# EAGLE design Rev0_4 (EAGLE 6.3)
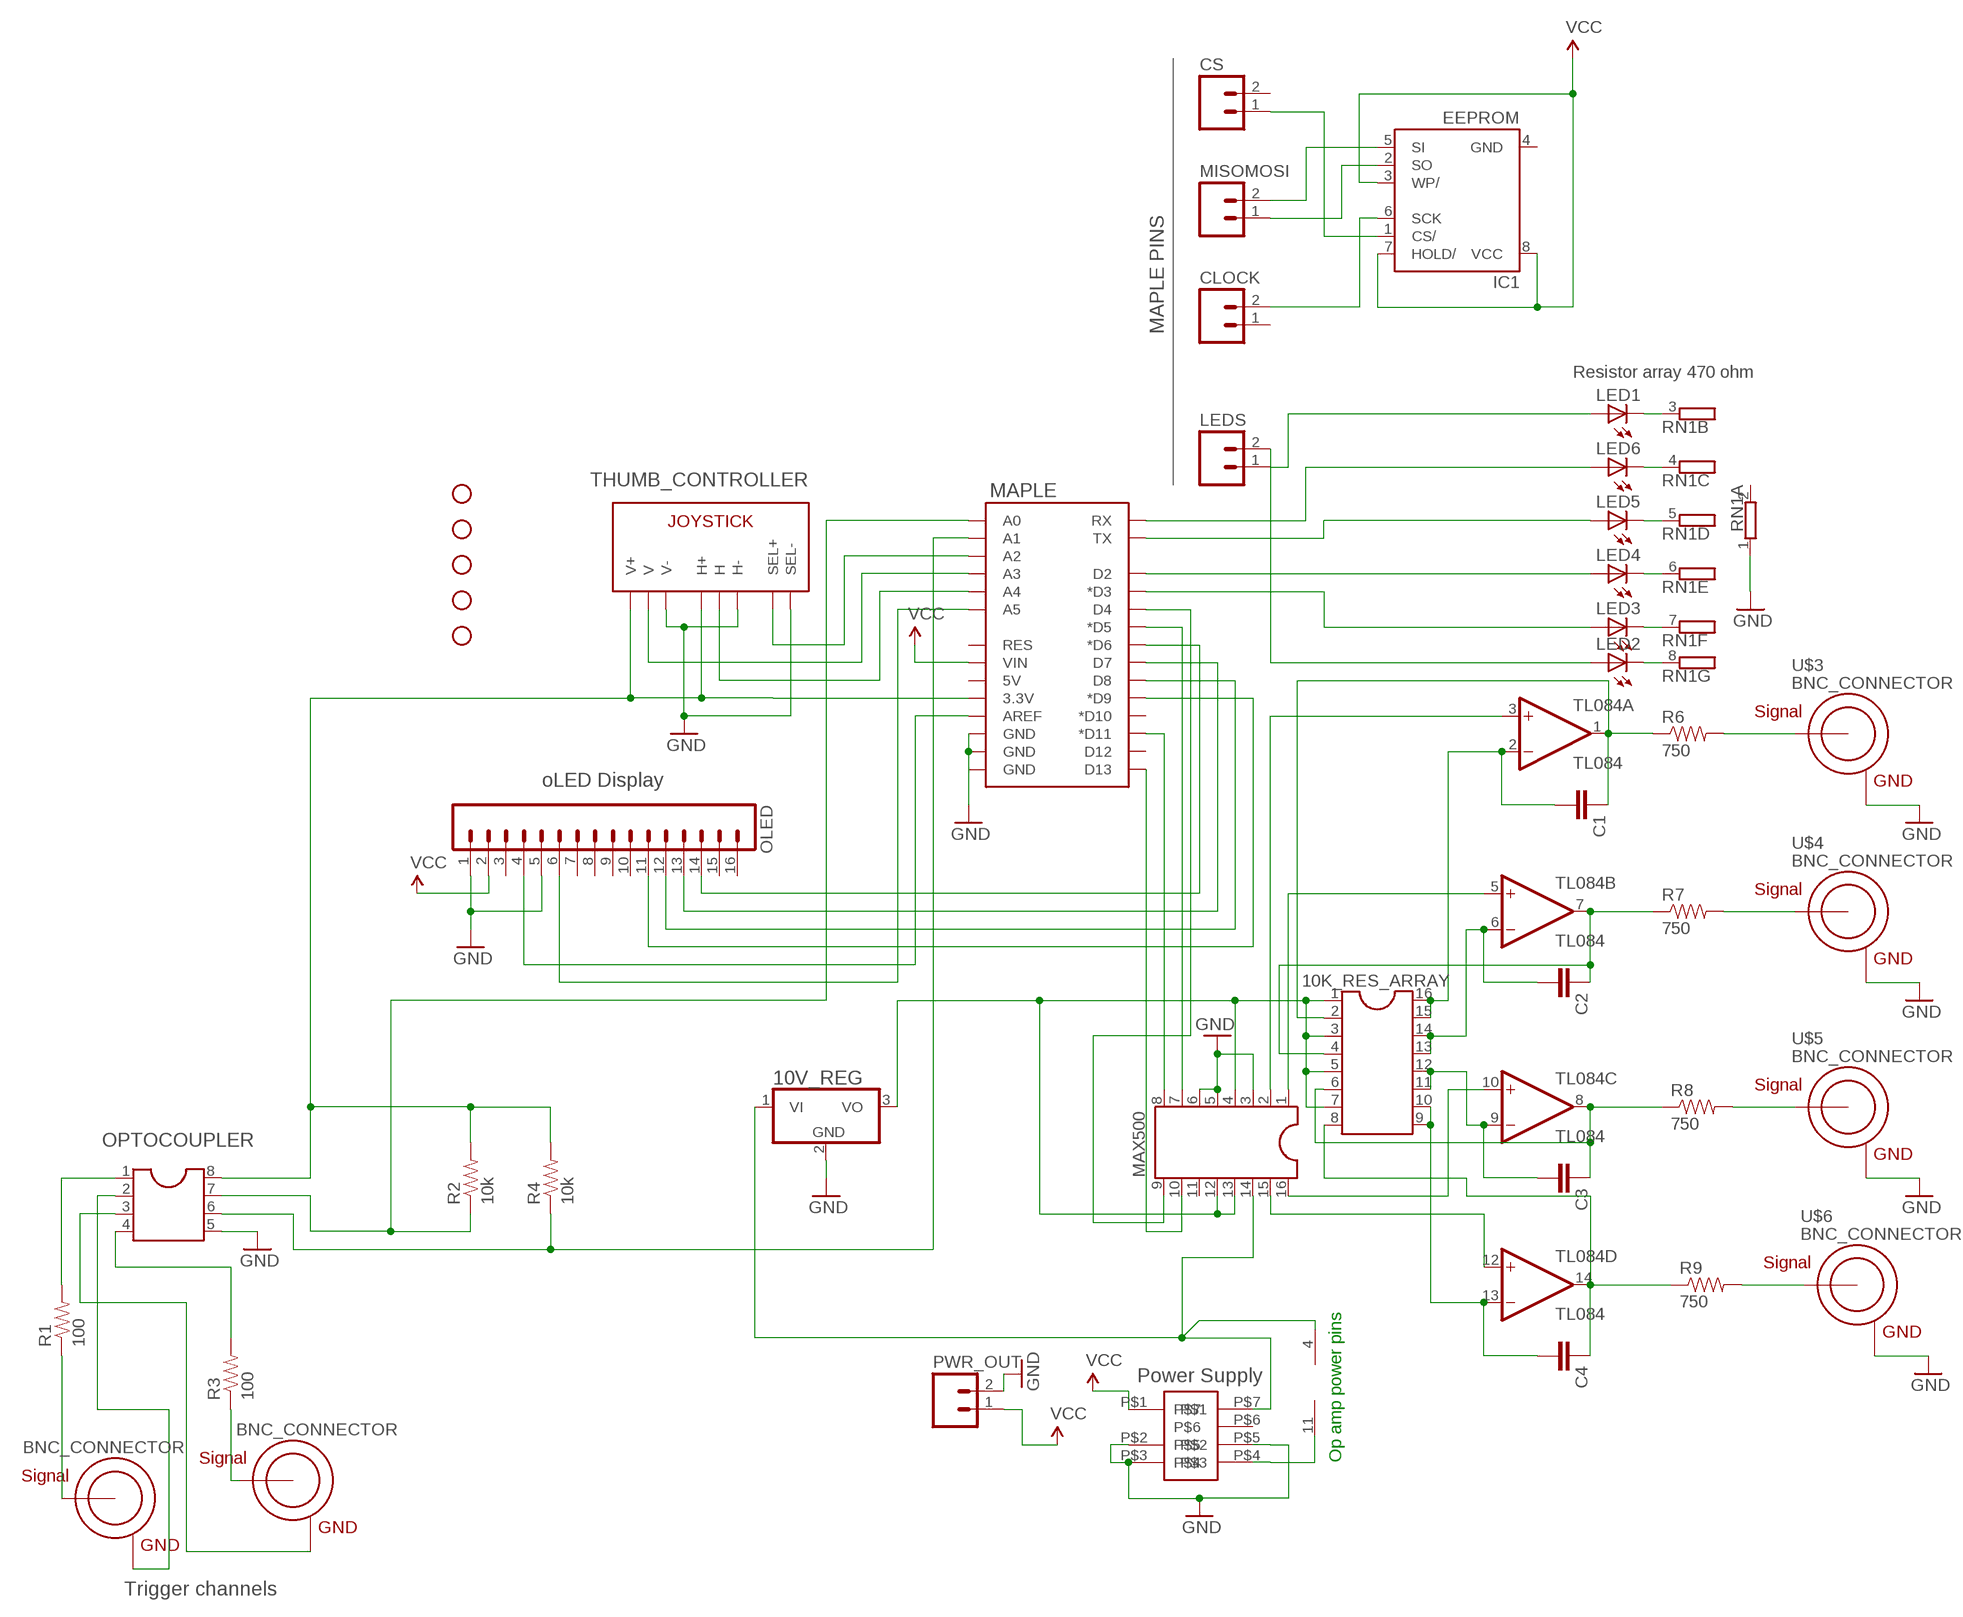
[diagram p0: schematic, sheet 1]

## Parts
10K_RES_ARRAY  DIL16  [DIL16]
10V_REG  7805T  [TO220H]
C1  CAPPTH  [CAP-PTH-SMALL]
C2  CAPPTH  [CAP-PTH-SMALL]
C3  CAPPTH  [CAP-PTH-SMALL]
C4  CAPPTH  [CAP-PTH-SMALL]
CLOCK  M02PTH  [1X02]
CS  M02PTH  [1X02]
IC1  EEPROM  AT25P  [DIL08]
JP2  STAND-OFF  [STAND-OFF]
JP5  STAND-OFF  [STAND-OFF]
JP6  STAND-OFF  [STAND-OFF]
JP8  STAND-OFF  [STAND-OFF]
JP9  STAND-OFF  [STAND-OFF]
LED1  LED3MM  [LED3MM]
LED2  LED3MM  [LED3MM]
LED3  LED3MM  [LED3MM]
LED4  LED3MM  [LED3MM]
LED5  LED3MM  [LED3MM]
LED6  LED3MM  [LED3MM]
LEDS  M02PTH  [1X02]
MAPLE  ARDUINO_SHIELDNOHOLESORLABELS  [DUEMILANOVE_SHIELD_NOHOLES_NOLABELS]
MAX500  DIL16  [DIL16]
MISOMOSI  M02PTH  [1X02]
OLED  M16PTH  [1X16]
OPTOCOUPLER  DIL8  [DIL08]
PWR_OUT  M02PTH  [1X02]
R1  100  RESISTORAXIAL-0.3  [AXIAL-0.3]
R2  10k  RESISTORAXIAL-0.3  [AXIAL-0.3]
R3  100  RESISTORAXIAL-0.3  [AXIAL-0.3]
R4  10k  RESISTORAXIAL-0.3  [AXIAL-0.3]
R6  750  RESISTORAXIAL-0.3  [AXIAL-0.3]
R7  750  RESISTORAXIAL-0.3  [AXIAL-0.3]
R8  750  RESISTORAXIAL-0.3  [AXIAL-0.3]
R9  750  RESISTORAXIAL-0.3  [AXIAL-0.3]
RN1  GE07R  [SIL8]
THUMB_CONTROLLER  JOYSTICKPTH  [JOYSTICK]
TL084  TL084  TL084P  [DIL14]
U$1  BNC_CONNECTOR  [BNC_CONNECTOR]
U$2  BNC_CONNECTOR  [BNC_CONNECTOR]
U$3  BNC_CONNECTOR  [BNC_CONNECTOR]
U$4  BNC_CONNECTOR  [BNC_CONNECTOR]
U$5  BNC_CONNECTOR  [BNC_CONNECTOR]
U$6  BNC_CONNECTOR  [BNC_CONNECTOR]
U$8  TDK_LAMBDA_5_TO_BI_12_125MA  [TDK_LAMBDA_5_TO_BI_12_125MA]

## Nets
GND: 10V_REG.2(GND) MAPLE.GND@0(GND) MAPLE.GND@1(GND) MAPLE.GND@2(GND) MAX500.3 MAX500.5 MAX500.6 OLED.1 OLED.5 OPTOCOUPLER.5 PWR_OUT.2 RN1.1 THUMB_CONTROLLER.B2A(SEL-) THUMB_CONTROLLER.H3(H-) THUMB_CONTROLLER.V3(V-) U$3.GND U$4.GND U$5.GND U$6.GND U$8.P$2 U$8.P$3 U$8.P$5
N$1: LED6.A MAPLE.RX
N$2: LED5.A MAPLE.TX
N$3: LED4.A MAPLE.D2
N$4: LED3.A MAPLE.D3(*D3)
N$5: MAPLE.D11(*D11) MAX500.8
N$6: MAPLE.D13 MAX500.10
N$7: MAPLE.AREF OLED.4
N$8: MAPLE.D4 MAX500.9
N$9: MAPLE.D5(*D5) MAX500.7
N$10: MAPLE.D6(*D6) OLED.14
N$11: MAPLE.D7 OLED.13
N$12: MAPLE.D8 OLED.12
N$13: MAPLE.D9(*D9) OLED.11
N$14: MAPLE.A5 OLED.6
N$15: MAPLE.A4 THUMB_CONTROLLER.H2(H)
N$16: MAPLE.A3 THUMB_CONTROLLER.V2(V)
N$17: MAPLE.A2 THUMB_CONTROLLER.B1A(SEL+)
N$19: R1.P$1 U$1.SIGNAL
N$20: MAPLE.A0 OPTOCOUPLER.7 R2.P$1
N$21: R3.P$1 U$2.SIGNAL
N$22: MAPLE.A1 OPTOCOUPLER.6 R4.P$1
N$23: TL084.11(P:V-) U$8.P$4
N$24: MAX500.2 TL084.3(A:+IN)
N$25: MAX500.1 TL084.5(B:+IN)
N$28: 10V_REG.1(VI) MAX500.14 TL084.4(P:V+) U$8.P$7
N$29: 10K_RES_ARRAY.1 10K_RES_ARRAY.3 10K_RES_ARRAY.5 10K_RES_ARRAY.7 10V_REG.3(VO) MAX500.4 MAX500.12 MAX500.13
N$30: MAX500.16 TL084.10(C:+IN)
N$31: MAX500.15 TL084.12(D:+IN)
N$32: 10K_RES_ARRAY.2 C1.1 R6.P$1 TL084.1(A:OUT)
N$33: 10K_RES_ARRAY.4 C2.1 R7.P$1 TL084.7(B:OUT)
N$34: 10K_RES_ARRAY.6 C3.1 R8.P$1 TL084.8(C:OUT)
N$35: 10K_RES_ARRAY.8 C4.1 R9.P$1 TL084.14(D:OUT)
N$36: LED1.A LEDS.1
N$37: LED2.A LEDS.2
N$38: LED2.K(C) RN1.8
N$39: LED3.K(C) RN1.7
N$40: LED4.K(C) RN1.6
N$41: LED5.K(C) RN1.5
N$42: LED6.K(C) RN1.4
N$43: 10K_RES_ARRAY.15 10K_RES_ARRAY.16 C1.2 TL084.2(A:-IN)
N$44: 10K_RES_ARRAY.13 10K_RES_ARRAY.14 C2.2 TL084.6(B:-IN)
N$45: 10K_RES_ARRAY.11 10K_RES_ARRAY.12 C3.2 TL084.9(C:-IN)
N$46: 10K_RES_ARRAY.9 10K_RES_ARRAY.10 C4.2 TL084.13(D:-IN)
N$47: LED1.K(C) RN1.3
N$48: R6.P$2 U$3.SIGNAL
N$49: R7.P$2 U$4.SIGNAL
N$50: R8.P$2 U$5.SIGNAL
N$51: R9.P$2 U$6.SIGNAL
N$52: OPTOCOUPLER.1 R1.P$2
N$53: CS.1 IC1.1(CS/)
N$54: IC1.5(SI) MISOMOSI.2
N$55: IC1.2(SO) MISOMOSI.1
N$56: CLOCK.2 IC1.6(SCK)
N$57: OPTOCOUPLER.2 U$1.GND
N$58: OPTOCOUPLER.4 R3.P$2
N$60: OPTOCOUPLER.3 U$2.GND
N$61: MAPLE.3.3V OPTOCOUPLER.8 R2.P$2 R4.P$2 THUMB_CONTROLLER.H1(H+) THUMB_CONTROLLER.V1(V+)
VCC: IC1.3(WP/) IC1.7(HOLD/) IC1.8(VCC) MAPLE.VIN OLED.2 PWR_OUT.1 U$8.P$1
Unconnected: CLOCK.1 CS.2 MAPLE.5V MAPLE.D10(*D10) MAPLE.D12 MAPLE.RES MAX500.11 OLED.3 OLED.7 OLED.8 OLED.9 OLED.10 OLED.15 OLED.16 RN1.2 U$8.P$6

## Notes on the sheet
- MAPLE PINS
- Resistor array 470 ohm
- oLED Display
- Power Supply
- Op amp power pins
- Trigger channels

## Power pins joined to a net without a drawn wire
GND: IC1.4(GND)

## Library data of the parts
10K_RES_ARRAY MAX500 = ic-package:DIL16: Dual In Line / Socket
10V_REG = linear:78*: Positive VOLTAGE REGULATOR Source: http://cache.national.com/ds/LM/LM78L05.pdf http://www.fairchildsemi.com/ds/LM/LM7805.pdf
C1-C4 = SparkFun:CAP: Capacitor Standard 0603 ceramic capacitor, and 0.1" leaded capacitor.
CLOCK CS LEDS MISOMOSI PWR_OUT = SparkFun:M02: Header 2 Standard 2-pin 0.1" header. Use with straight break away headers (SKU : PRT-00116), right angle break away headers (PRT-00553), swiss pins (PRT-00743), machine pins (PRT-00117), and female headers (PRT-00115). Molex polarized connector foot print use with SKU : PRT-08233 with associated crimp pins and housings.
IC1 = atmel:AT25*: SPI bus serial EEPROM
JP2 JP5 JP6 JP8 JP9 = SparkFun:STAND-OFF: Stand Off This is the mechanical footprint for a #4 phillips button head screw. Use the keepout ring to avoid running the screw head into surrounding components. SKU : PRT-00447
LED1-LED6 = SparkFun:LED: LEDs Standard schematic elements and footprints for 5mm, 3mm, 1206, and 0603 sized LEDs. 5mm - Spark Fun Electronics SKU : COM-00529 (and others)
MAPLE = SparkFun:ARDUINO_SHIELD
OLED = SparkFun:M16
OPTOCOUPLER = ic-package:DIL8: Dual In Line / Socket
R1-R4 R6-R9 = SparkFun:RESISTOR: Resistor Basic schematic elements and footprints for 0603, 1206, and PTH resistors.
RN1 = resistor-sil:GE07R: SIL RESISTOR
THUMB_CONTROLLER = SparkFun:JOYSTICK: Thumb Joystick Joystick commonly found in PS2 controllers. Two pots and a select switch. Footprint proven. Spark Fun Electronics SKU : COM-09032
TL084 = linear:TL084: OP AMP
U$1-U$6 = JoshParts:BNC_CONNECTOR
U$8 = JoshParts:TDK_LAMBDA_5_TO_BI_12_125MA

## Net classes
0 default: width 0.203 mm
1 vcc: width 0.254 mm

## Board
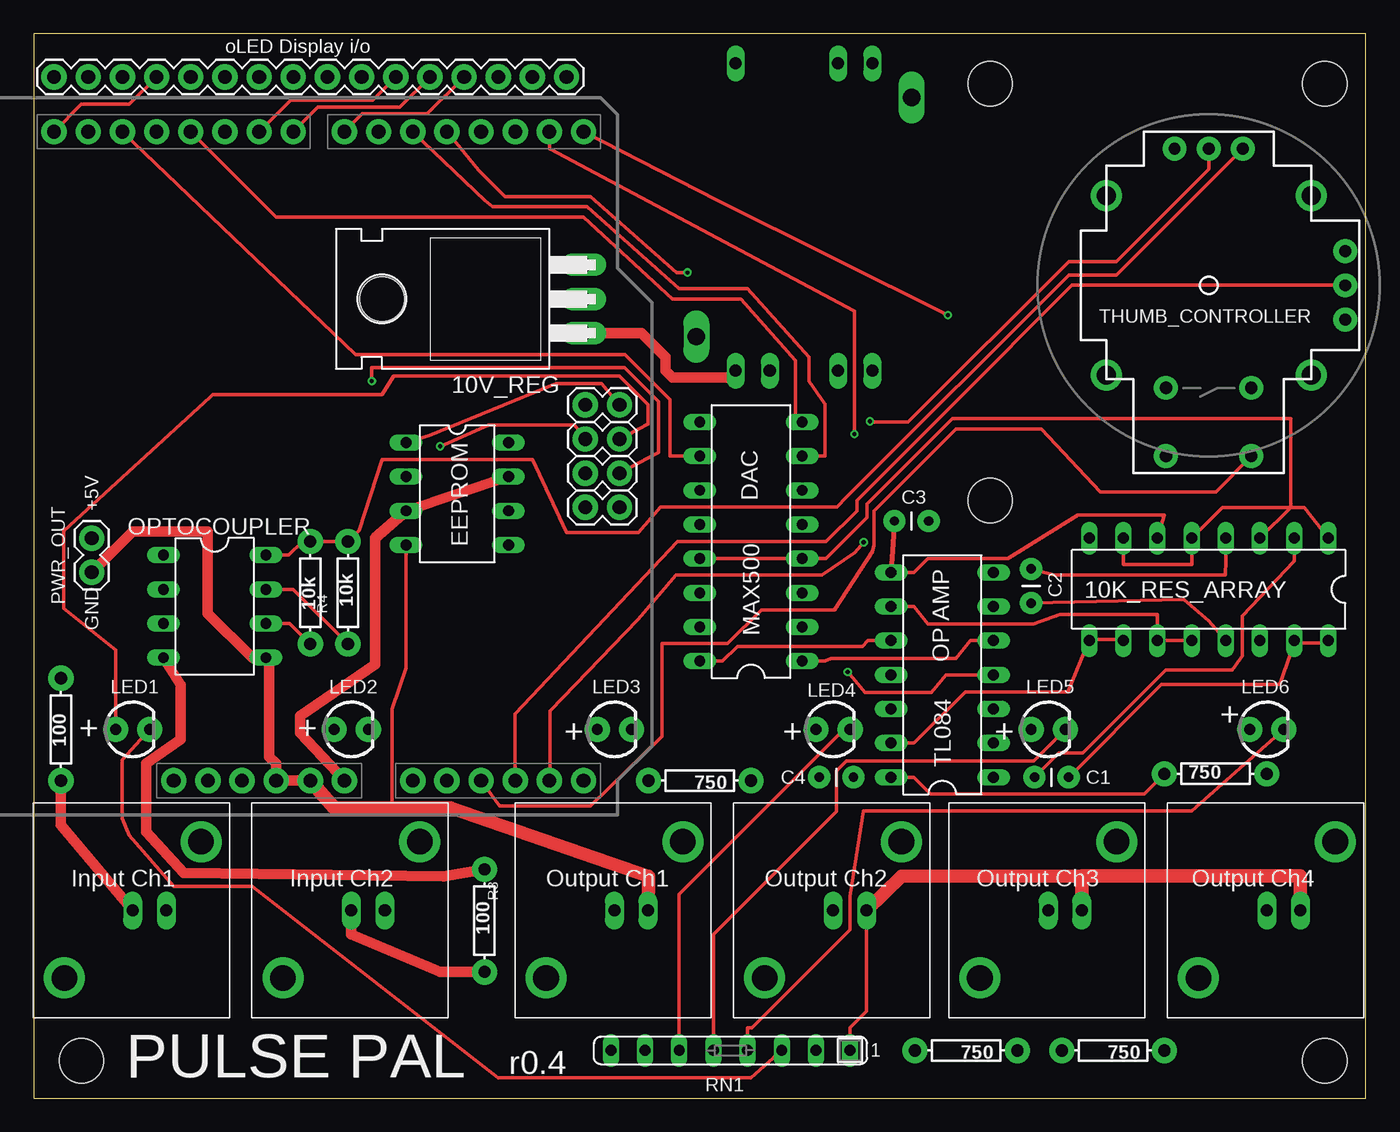
[diagram p1: board, top side]
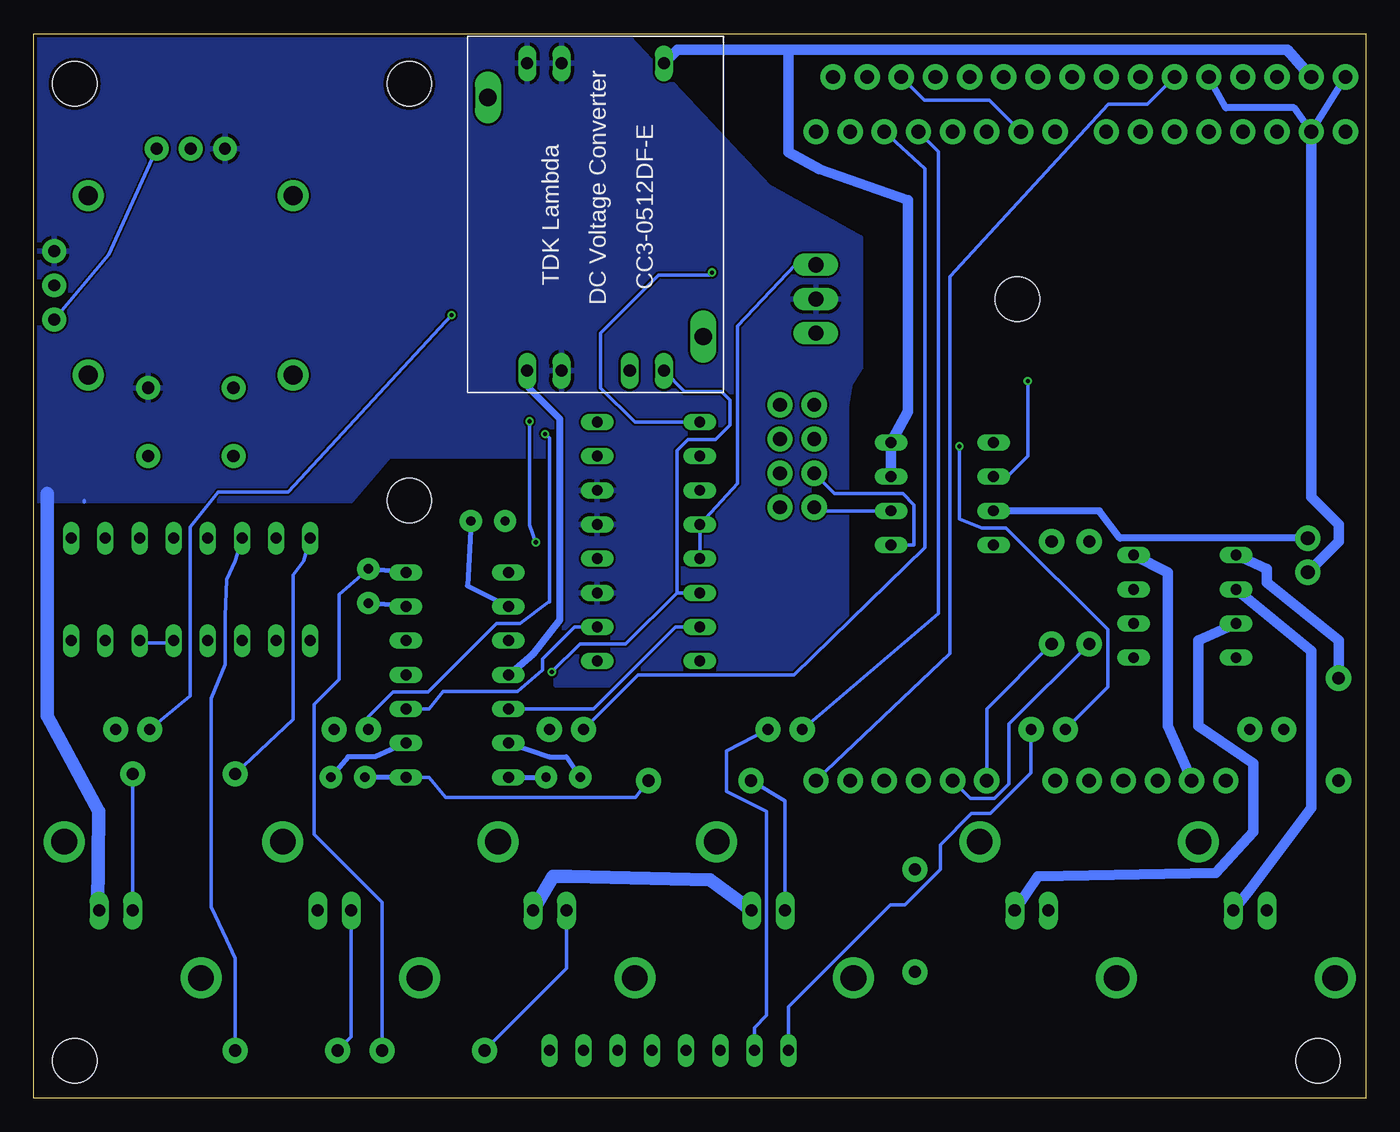
[diagram p2: board, bottom side, seen from below]

Size 99.04 x 79.17 mm. Coordinates in mm from the lower left corner, seen from the top.
Outline: 99.04,79.17 0,79.17 0,0 99.04,0 99.04,79.17
Copper layers (1*2*15*16): Top 0.035mm / dielectric 0.2mm / Route2 0.0175mm / dielectric 1.1mm / Route15 0.0175mm / dielectric 0.2mm / Bottom 0.035mm
Design rules "SeeedStudio_DRU_no_angle_20130527": minimum track width 6mil, minimum drill 12mil, track to track 6mil, track to pad 6mil, pad to pad 6mil, via to via 6mil, smd to smd 0mil, copper to edge 10mil, drill to drill 10mil, minimum pad ring 6mil, minimum via ring 6mil, stop-mask expansion 2mil, vias tented up to drill 25mil, thermal gap 10mil

### Footprints (pad centres in the part's own frame; a part is rotated, then mirrored left to right if it is on the bottom)
DIL16 = drill 0.813 long: 1 -8.89,-3.81; 2 -6.35,-3.81; 3 -3.81,-3.81; 4 -1.27,-3.81; 5 1.27,-3.81; 6 3.81,-3.81; 7 6.35,-3.81; 8 8.89,-3.81; 9 8.89,3.81; 10 6.35,3.81; 11 3.81,3.81; 12 1.27,3.81; 13 -1.27,3.81; 14 -3.81,3.81; 15 -6.35,3.81; 16 -8.89,3.81
TO220H = drill 1.118 long: 1 -2.54,-10.16; 2 0,-10.16; 3 2.54,-10.16 | hole 3.302: 0,4.826
CAP-PTH-SMALL = drill 0.7 pad 1.651: 1 0,0; 2 2.54,0
1X02 = drill 1.016 pad 1.88: 1 0,0; 2 2.54,0
DIL08 = drill 0.813 long: 1 -3.81,-3.81; 2 -1.27,-3.81; 3 1.27,-3.81; 4 3.81,-3.81; 5 3.81,3.81; 6 1.27,3.81; 7 -1.27,3.81; 8 -3.81,3.81
STAND-OFF = hole 3.302: 0,0
LED3MM = drill 0.813 pad 1.88: A -1.27,0; K 1.27,0
DUEMILANOVE_SHIELD_NOHOLES_NOLABELS = drill 1.016 pad 1.88: 3.3V 50.8,26.67; 5V 50.8,29.21; A0 50.8,41.91; A1 50.8,44.45; A2 50.8,46.99; A3 50.8,49.53; A4 50.8,52.07; A5 50.8,54.61; AREF 2.54,15.24; D2 2.54,49.53; D3 2.54,46.99; D4 2.54,44.45; D5 2.54,41.91; D6 2.54,39.37; D7 2.54,36.83; D8 2.54,33.02; D9 2.54,30.48; D10 2.54,27.94; D11 2.54,25.4; D12 2.54,22.86; D13 2.54,20.32; GND@0 50.8,31.75; GND@1 50.8,34.29; GND@2 2.54,17.78; RES 50.8,24.13; RX 2.54,54.61; TX 2.54,52.07; VIN 50.8,36.83
1X16 = drill 1.016 pad 1.88: 1 0,0; 2 2.54,0; 3 5.08,0; 4 7.62,0; 5 10.16,0; 6 12.7,0; 7 15.24,0; 8 17.78,0; 9 20.32,0; 10 22.86,0; 11 25.4,0; 12 27.94,0; 13 30.48,0; 14 33.02,0; 15 35.56,0; 16 38.1,0
AXIAL-0.3 = drill 0.9 pad 1.88: P$1 -3.81,0; P$2 3.81,0
SIL8 = drill 0.813 long: 1 -8.89,0; 2 -6.35,0; 3 -3.81,0; 4 -1.27,0; 5 1.27,0; 6 3.81,0; 7 6.35,0; 8 8.89,0
JOYSTICK = drill 0.9 pad 1.778: B1A -3.175,12.7; B1B 3.175,12.7; B2A -3.175,7.62; B2B 3.175,7.62 | drill 0.889 pad 1.778: H1 -2.54,-10.16; H2 0,-10.16; H3 2.54,-10.16; V1 -10.16,2.54; V2 -10.16,0; V3 -10.16,-2.54 | drill 1.397 pad 2.286: MOUNT1 -7.62,6.668; MOUNT2 -7.62,-6.668; MOUNT3 7.62,-6.668; MOUNT4 7.62,6.668
DIL14 = drill 0.813 long: 1 -7.62,-3.81; 2 -5.08,-3.81; 3 -2.54,-3.81; 4 0,-3.81; 5 2.54,-3.81; 6 5.08,-3.81; 7 7.62,-3.81; 8 7.62,3.81; 9 5.08,3.81; 10 2.54,3.81; 11 0,3.81; 12 -2.54,3.81; 13 -5.08,3.81; 14 -7.62,3.81
BNC_CONNECTOR = drill 0.9 pad 1.422 long: GND -2.492,0; SIGNAL 0,0 | drill 1.9 pad 3.048: P$3 5.076,5.025; P$4 -5.089,-5.102
TDK_LAMBDA_5_TO_BI_12_125MA = drill 0.9 long: P$1 0,-2.92; P$2 0,-10.54; P$3 0,-13.08; P$4 22.86,-13.08; P$5 22.86,-10.54; P$6 22.86,-5.46; P$7 22.86,-2.92 | drill 1.3 long: P$8 20.32,0; P$9 2.54,-16

### Placement (x,y rotation side)
10K_RES_ARRAY  87.38,37.85 180 top
10V_REG  30.73,59.44 90 top
C1  74.42,23.88 0 top
C2  74.17,39.37 270 top
C3  64.01,42.93 0 top
C4  60.96,23.88 180 top
CLOCK  43.56,43.94 180 top
CS  43.56,51.56 180 top
IC1  31.5,44.96 270 top
JP2  71.12,75.44 0 top
JP5  96.01,2.79 0 top
JP6  96.01,75.44 0 top
JP8  71.12,44.45 0 top
JP9  3.56,2.79 0 top
LED1  7.37,27.43 0 top
LED2  23.62,27.43 0 top
LED3  43.18,27.43 0 top
LED4  59.44,27.43 0 top
LED5  75.44,27.43 0 top
LED6  91.69,27.43 0 top
LEDS  43.56,49.02 180 top
MAPLE  -13.72,74.42 270 top
MAX500  53.34,41.4 90 top
MISOMOSI  43.56,46.48 180 top
OLED  1.52,75.95 0 top
OPTOCOUPLER  13.46,36.58 270 top
PWR_OUT  4.32,41.66 270 top
R1  2.03,27.43 90 top
R2  23.37,37.59 90 top
R3  33.53,13.21 90 top
R4  20.57,37.59 90 top
R6  49.53,23.62 180 top
R7  69.34,3.56 180 top
R8  80.26,3.56 180 top
R9  87.88,24.13 0 top
RN1  51.82,3.56 180 top
THUMB_CONTROLLER  87.38,60.45 180 top
TL084  67.56,31.5 90 top
U$1  7.37,13.97 180 top
U$2  23.62,13.97 180 top
U$3  43.18,13.97 180 top
U$4  59.44,13.97 180 top
U$5  75.44,13.97 180 top
U$6  91.69,13.97 180 top
U$8  49.28,76.96 270 bottom

### Tracks (layer width: path | path; a pad name or v marks a point on that pad's centre or on a via)
GND
  Top 0.254: U$4.GND 61.93,6.48 60.71,5.26 RN1.1 | 77.93,16.54 77.93,15.77 | U$3.GND 45.67,15.77 | IC1.4 27.69,32 26.67,28.96 26.67,21.59
  Top 0.762: MAPLE.GND@1 MAPLE.GND@0 18.03,24.89 17.53,25.4 17.53,32.51 OPTOCOUPLER.5 16.26,32.77 12.95,36.07 12.95,42.16 7.37,42.16 PWR_OUT.2
  Top 1.016: 77.93,16.54 94.19,16.54 94.23,13.46 U$6.GND | U$5.GND 77.93,16.54 | 77.93,16.54 64.52,16.51 U$4.GND | MAPLE.GND@1 22.35,21.59 26.67,21.59 30.99,21.59 45.72,16.51 U$3.GND
  Bottom 0.254: 95.3,44.35 95.3,44.45 | 94.28,14.07 U$6.GND
  Bottom 0.508: OLED.1 MAPLE.GND@2 5.33,73.66 10.41,73.66 OLED.5
  Bottom 0.762: MAPLE.GND@2 4.06,44.7 2.03,42.67 2.03,41.4 PWR_OUT.2
  Bottom 1.016: 98.04,44.96 98.04,28.45 94.23,21.34 94.28,14.07 94.23,13.72 | U$3.GND 48.77,16.26 59.18,16.51 60.45,16.51 U$4.GND
  pour Bottom: 37.59,54.36 37.59,64.01 44.45,67.82 55.37,79.5 100.08,79.76 100.08,44.45 75.44,44.45 72.64,47.75 60.2,47.75 60.2,30.73 39.88,30.73 38.61,30.48 38.61,51.56 38.35,53.09
N$1  (via drill 0.3 pad 0.61)
  Top 0.254: MAPLE.RX 50.79,66.8 v67.99,58.24
  Bottom 0.254: v67.99,58.24 80.14,45.07 85.34,45.07 87.41,42.5 87.41,29.94 LED6.A
N$2  (via drill 0.3 pad 0.61)
  Top 0.254: MAPLE.TX 38.35,70.62 61.02,58.55 v61.02,49.4
  Bottom 0.254: LED5.A 74.17,28.39 72.33,30.23 69.73,30.23 64.65,35.31 62.88,35.31 60.77,36.91 60.71,36.91 60.71,49.02 60.71,49.09 v61.02,49.4
N$3
  Bottom 0.254: LED4.A 54.13,31.47 42.54,31.47 32.8,40.95 32.8,69.13 MAPLE.D2
N$4
  Bottom 0.254: LED3.A 31.78,36.04 31.78,70.39 MAPLE.D3
N$5
  Top 0.254: MAPLE.D11 18.03,65.53 40.89,65.53 47.5,59.44 52.58,59.44 56.64,54.86 56.64,50.8 MAX500.8
N$6
  Top 0.254: MAX500.10 47.32,47.75 47.32,51.96 43.98,55.3 23.95,55.3 MAPLE.D13
N$7
  Top 0.254: MAPLE.AREF 3.56,73.91 7.11,73.91 OLED.4
N$8  (via drill 0.3 pad 0.61)
  Top 0.254: MAPLE.D4 33.08,69.03 35.05,67.06 41.4,67.06 47.81,61.41 v48.63,61.41
  Bottom 0.254: MAX500.9 54.36,50.29 56.9,52.83 56.9,56.13 56.9,56.39 56.9,56.9 52.58,61.21 48.82,61.21 v48.63,61.41
N$9
  Top 0.254: MAX500.7 58.85,47.75 58.85,50.74 58.85,51.64 57.66,53.34 57.66,55.12 53.09,60.2 48.01,60.2 41.15,66.29 34.11,66.29 33.57,66.76 MAPLE.D5
N$10
  Bottom 0.254: MAPLE.D6 28,74.23 32.83,74.23 OLED.14
N$11
  Top 0.254: MAPLE.D7 24.43,73.2 29.26,73.2 OLED.13
N$12
  Top 0.254: OLED.12 27.23,73.71 21.13,73.71 MAPLE.D8
N$13
  Top 0.254: MAPLE.D9 19.11,74.23 25.2,74.23 OLED.11
N$14
  Bottom 0.254: MAPLE.A5 30.92,33.09 30.92,61.12 19.14,73.91 16.26,73.91 OLED.6
N$15  (via drill 0.3)
  Top 0.254: v61.72,41.35 61.06,40.59 58.62,38.91 47.75,38.91 44.96,35.61 38.41,28.8 38.41,23.62 MAPLE.A4 | 87.38,70.76 THUMB_CONTROLLER.H2 87.38,69.09 80.52,62.23 76.96,62.23 65.02,50.29 62.23,50.29 v62.18,50.34
  Bottom 0.254: v62.18,50.34 62.18,42.62 v61.72,41.35
N$16
  Top 0.254: MAPLE.A3 35.81,28.57 47.88,41.4 58.6,41.4 58.67,41.4 58.93,41.4 61.21,43.69 61.21,44.45 68.33,51.56 77.22,60.45 THUMB_CONTROLLER.V2
N$17
  Top 0.254: MAPLE.A2 34.63,21.76 41.42,21.76 46.74,26.92 46.74,33.81 51.59,33.81 54.11,36.32 59.55,36.32 62.37,40.67 62.48,41.15 62.48,43.69 68.58,49.78 74.93,49.78 79.31,45.1 87.9,45.1 THUMB_CONTROLLER.B1A
N$19
  Top 0.762: U$1.SIGNAL 2.03,20.32 R1.P$1
N$20
  Top 0.254: R2.P$1 19.3,37.85 OPTOCOUPLER.7
  Bottom 0.254: MAPLE.A0 28.19,28.96 R2.P$1
N$21
  Top 0.762: U$2.SIGNAL 23.62,12.19 30.23,9.4 R3.P$1
N$22
  Top 0.254: R4.P$1 19.05,35.31 OPTOCOUPLER.6
  Bottom 0.254: MAPLE.A1 29.4,22.28 27.62,22.28 26.53,23.38 26.53,27.83 R4.P$1
N$23
  Bottom 0.508: TL084.11 61.98,33.02 59.94,35.56 59.94,50.55 62.23,52.83 62.23,53.98 U$8.P$4
N$24
  Bottom 0.254: MAX500.2 58.85,35.05 61.22,32.68 61.22,31.85 63.07,30.25 68.63,30.25 69.67,28.96 TL084.3
N$25
  Top 0.254: MAX500.1 58.85,32.51 59.28,32.69 68.58,32.69 69.67,34.04 TL084.5
N$28  (via drill 0.3 pad 0.61)
  Top 0.254: v60.53,31.7 61.81,30.16 66.77,30.16 67.85,31.5 TL084.4
  Top 0.762: 10V_REG.1 45.21,56.9 46.99,55.12 46.99,54.1 47.5,53.59 51.69,53.59 U$8.P$7
  Bottom 0.254: v60.53,31.7 58.45,33.78 55.04,33.78 51.23,37.59 | MAX500.14 51.23,37.59 | 51.23,37.59 51.23,48.19 50.42,49 48.35,49 47.29,50.06 47.29,51.94 47.92,52.57 50.66,52.57 U$8.P$7
N$29
  Top 0.254: MAX500.13 MAX500.4 58.85,40.13 58.93,40.13 61.98,43.18 61.98,44.2 62.23,44.45 68.33,50.55 90.17,50.55 93.47,50.55 93.47,43.94 | 10K_RES_ARRAY.7 81.03,39.7 86.11,39.7 10K_RES_ARRAY.5 88.39,43.94 89.66,43.94 93.47,43.94 | 94.49,43.94 93.47,43.94 | 93.47,43.94 10K_RES_ARRAY.3 | 10K_RES_ARRAY.1 94.49,43.94 | 93.47,43.94 94.49,43.94
  Bottom 0.254: MAX500.13 MAX500.12 46.74,45.72 46.74,57.4 42.42,61.98 10V_REG.3
N$30
  Top 0.254: MAX500.16 51.23,32.51 52.32,33.6 61.62,33.6 62.05,34.04 TL084.10
N$31
  Bottom 0.254: TL084.12 57.41,28.96 51.31,35.05 MAX500.15
N$32
  Top 0.254: C1.1 76.25,25.7 78.03,25.7 84.18,31.85 89.11,31.85 89.88,32.88 89.88,35.85 93.73,39.95 10K_RES_ARRAY.2
  Bottom 0.254: TL084.1 69.67,23.88 68.44,22.39 54.32,22.39 R6.P$1
  Bottom 0.381: TL084.1 C1.1
N$33
  Top 0.254: C2.1 75.91,38.9 88.61,38.9 88.65,39.95 10K_RES_ARRAY.4
  Bottom 0.254: C2.1 76.34,37.45 76.34,31.14 78.19,29.3 78.19,19.62 73.15,14.58 R7.P$1
  Bottom 0.381: TL084.7 C2.1
N$34
  Top 0.254: 10K_RES_ARRAY.6 84.07,43.36 77.66,43.36 72.42,40.16 66.5,40.16 65.46,39.12 TL084.8
  Top 0.381: C3.1 TL084.8
  Bottom 0.254: 10K_RES_ARRAY.6 84.07,39.95 84.7,38.57 84.84,35.81 84.84,32.26 85.85,29.72 85.85,14.22 84.7,11.8 84.07,10.41 R8.P$1
N$35
  Top 0.254: TL084.14 65.46,23.88 66.69,22.64 82.59,22.64 R9.P$1
  Bottom 0.254: 10K_RES_ARRAY.8 78.99,39.95 79.78,38.91 79.78,28.17 R9.P$1
  Bottom 0.381: TL084.14 C4.1
N$36
  Top 0.254: LEDS.1 45.68,50.12 45.68,51.58 43.56,53.7 26.77,53.7 25.91,52.32 13.32,52.32 13.14,52.14 2.22,42.19 2.22,36.44 6.1,33.32 LED1.A
N$37  (via drill 0.3 pad 0.61)
  Top 0.254: LEDS.2 40.23,50.07 33.84,50.07 v30.23,48.48
  Bottom 0.254: LED2.A 19.2,30.58 19.2,34.84 26.77,42.42 28.55,42.42 30.23,43.08 v30.23,48.48
N$38
  Bottom 0.254: RN1.8 42.93,6.82 35.36,14.38 34.28,14.38 31.65,17.01 31.65,18.86 29.34,21.17 27.93,21.17 24.89,24.21 LED2.K
N$39
  Bottom 0.254: RN1.7 45.47,5.26 44.56,6.17 44.56,21.34 47.56,22.82 47.56,25.85 LED3.K
N$40
  Top 0.254: RN1.6 48.01,15.17 60.27,27.43 LED4.K
N$41
  Top 0.254: RN1.5 50.55,12.2 59.69,21.34 59.69,24.33 60.44,25.08 74.36,25.08 LED5.K
N$42
  Top 0.254: RN1.4 53.09,5.26 53.4,5.26 60.68,12.54 60.68,15 61.71,21.36 86.13,21.36 LED6.K
N$43
  Top 0.254: C1.2 83.86,30.77 92.67,30.77 93.73,33.86 | 10K_RES_ARRAY.16 96.27,33.86 93.73,33.86 | 10K_RES_ARRAY.15 93.73,33.86
  Bottom 0.381: TL084.2 73.66,25.4 75.69,25.4 C1.2
N$44
  Top 0.254: 10K_RES_ARRAY.13 87.38,35.48 85.52,37.08 C2.2
  Bottom 0.254: 10K_RES_ARRAY.13 88.65,33.86 91.19,33.86 10K_RES_ARRAY.14
  Bottom 0.381: TL084.6 C2.2
N$45
  Top 0.254: TL084.9 65.46,36.58 66.5,35.28 74.33,35.28 76.31,35.99 83.57,35.99 10K_RES_ARRAY.11 10K_RES_ARRAY.12
  Bottom 0.381: C3.2 66.8,38.1 TL084.9
N$46
  Top 0.254: TL084.13 65.46,26.42 69.27,30.23 76.89,30.23 78.49,34.11 | 10K_RES_ARRAY.10 81.03,34.11 78.49,34.11 | 10K_RES_ARRAY.9 78.49,34.11
  Bottom 0.381: TL084.13 60.71,25.4 59.44,25.4 C4.2
N$47
  Top 0.254: RN1.3 53.34,1.52 34.54,1.52 16.26,15.75 10.41,15.75 7.11,19.56 6.6,20.83 6.6,25.15 LED1.K
N$48
  Bottom 0.254: R6.P$2 43.18,22.1 43.18,15.77 U$3.SIGNAL
N$49
  Bottom 0.254: U$4.SIGNAL 59.44,9.65 R7.P$2
N$50
  Bottom 0.254: U$5.SIGNAL 75.44,4.57 R8.P$2
N$51
  Bottom 0.254: U$6.SIGNAL R9.P$2
N$52
  Bottom 0.762: R1.P$2 2.03,34.04 7.37,38.35 7.37,39.37 OPTOCOUPLER.1
N$53
  Top 0.254: IC1.1 29.39,49.28 38.85,53.15 42.23,53.15 CS.1
N$54
  Bottom 0.254: IC1.5 33.6,41.15 33.6,44.13 34.44,44.96 39.5,44.96 MISOMOSI.2
N$55  (via drill 0.3 pad 0.61)
  Top 0.254: MISOMOSI.1 46.48,48.01 46.48,51.82 43.94,54.36 25.15,54.36 v25.15,53.34
  Bottom 0.254: v25.15,53.34 25.15,47.75 26.67,46.23 IC1.2
N$56
  Bottom 0.254: IC1.6 40.77,43.69 CLOCK.2
N$57
  Bottom 0.762: U$1.GND 8.64,15.49 4.06,21.59 4.06,33.27 OPTOCOUPLER.2
N$58
  Top 0.762: R3.P$2 30.48,16.51 11.18,16.76 8.38,19.81 8.38,24.89 10.92,26.67 10.92,30.73 OPTOCOUPLER.4
N$60
  Bottom 0.762: U$2.GND 24.38,16.51 11.18,16.76 8.38,19.81 8.38,24.89 12.45,27.69 12.45,34.04 OPTOCOUPLER.3
N$61
  Top 0.254: OPTOCOUPLER.8 18.97,40.39 19.99,41.4 R4.P$2 R2.P$2 24.19,42.23 25.91,47.5 37.08,47.5 39.62,42.07 44.99,42.07 46.63,43.97 58.59,43.97 59.72,43.97 60.45,44.7 76.96,61.21 80.52,61.21 THUMB_CONTROLLER.H1
  Bottom 0.254: THUMB_CONTROLLER.H1 93.47,62.74 THUMB_CONTROLLER.V1
  Bottom 0.762: MAPLE.3.3V 14.73,27.69 14.73,39.12 OPTOCOUPLER.8
VCC
  Top 0.762: MAPLE.VIN 19.81,27.18 19.81,28.45 25.4,32.26 25.4,41.66 IC1.3 IC1.7
  Bottom 0.508: PWR_OUT.1 18.29,41.66 19.81,43.69 IC1.3
  Bottom 0.762: IC1.7 IC1.8 34.04,51.05 34.04,66.8 40.64,69.09 42.93,70.36 42.93,77.98 | OLED.2 5.84,77.98 42.93,77.98 | 42.93,77.98 46.48,77.98 51.18,77.98 U$8.P$1

### Text on the board
tPlace: oLED Display i/o | DAC | +5V | OP AMP | R4 | GND | + | + | + | + | + | + | Input Ch1 | Input Ch2 | Output Ch1 | Output Ch2 | Output Ch3 | Output Ch4 | R3 | PULSE PAL | r0.4